# Altium schematic sheet Light Gates.SchDoc: Dual Feeder -
size Letter; DrawnBy: Mark Harris; Engineer: Mark Harris; Organization: Mark Harris; ProjectName: Dual Feeder Controller
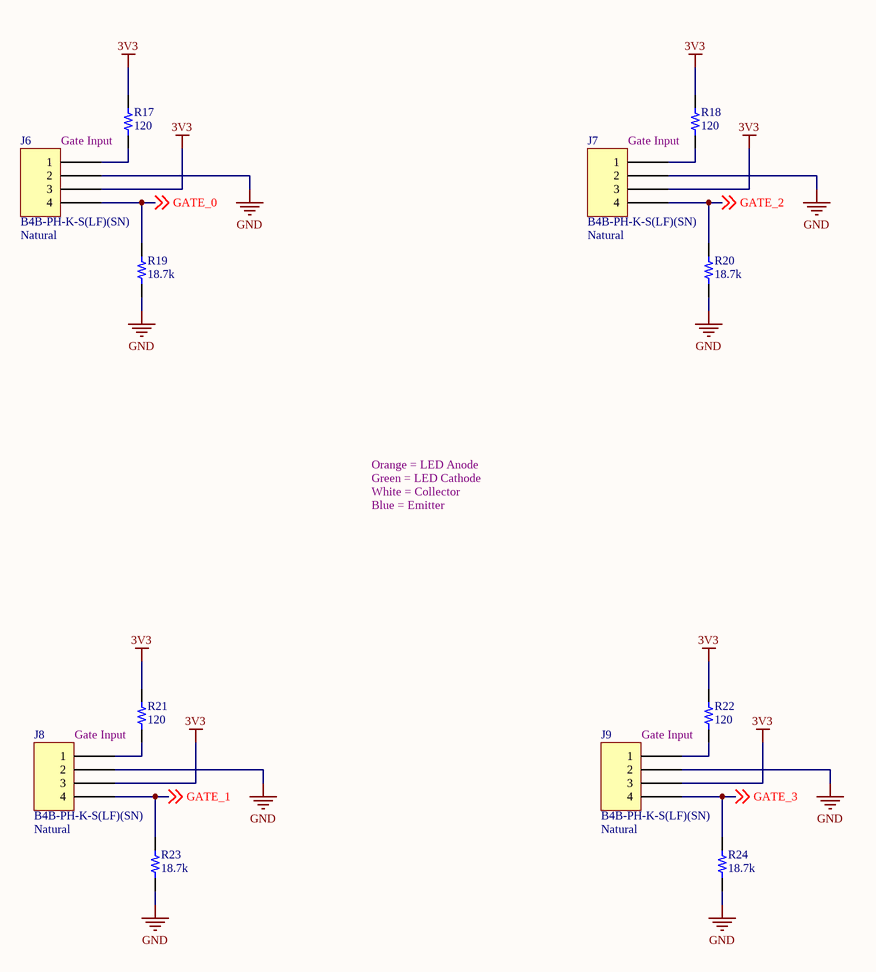
[diagram p0: Light Gates.SchDoc]

## Parts
J6  B4B-PH-K-S(LF)(SN)  Colour: Natural  [JST B4B-PH-K]
J7  B4B-PH-K-S(LF)(SN)  Colour: Natural  [JST B4B-PH-K]
J8  B4B-PH-K-S(LF)(SN)  Colour: Natural  [JST B4B-PH-K]
J9  B4B-PH-K-S(LF)(SN)  Colour: Natural  [JST B4B-PH-K]
R17  120  [RES 0603/1608]
R18  120  [RES 0603/1608]
R19  18.7k  [RES 0603/1608]
R20  18.7k  [RES 0603/1608]
R21  120  [RES 0603/1608]
R22  120  [RES 0603/1608]
R23  18.7k  [RES 0603/1608]
R24  18.7k  [RES 0603/1608]

## Nets
3V3: J6.3 J7.3 J8.3 J9.3 R17.2 R18.2 R21.2 R22.2
GND: J6.2 J7.2 J8.2 J9.2 R19.1 R20.1 R23.1 R24.1
GATE_0: J6.4 R19.2 ; off-sheet GATE_0
GATE_1: J8.4 R23.2 ; off-sheet GATE_1
GATE_2: J7.4 R20.2 ; off-sheet GATE_2
GATE_3: J9.4 R24.2 ; off-sheet GATE_3
NetJ6_1: J6.1 R17.1
NetJ7_1: J7.1 R18.1
NetJ8_1: J8.1 R21.1
NetJ9_1: J9.1 R22.1

## Notes on the sheet
- Gate Input
- Orange = LED Anode
- Green = LED Cathode
- Blue = Emitter
- White = Collector
- Title
- Size:
- Date:
- Letter
- Number:
- Time:
- Revision:
- Sheet
- of
- File:

## Library data of the parts
J6-J9 = B4B-PH-K-S(LF)(SN): CONN HEADER PH TOP 4POS 2MM; Manufacturer: JST Sales America Inc.; Pitch: 0.079" (2.00mm); Number Of Positions: 4; Part Number: B4B-PH-K-S(LF)(SN); PartId: 29449; Supplier 1: Digi-Key; Supplier Part Number 1: 455-1706-ND; ComponentLink1Description: Datasheet; ComponentLink1URL: http://www.jst-mfg.com/product/pdf/eng/ePH.pdf; ComponentLink2Description: Digi-Key Listing; ComponentLink2URL: http://www.digikey.com/product-detail/en/jst-sales-america-inc/B4B-PH-K-S(LF)(SN)/455-1706-ND/926613; Price: 0.24; Type: Header, Shrouded; Contact Finish: Tin; Fastening Type: Detent Lock; Number Of Rows: 1; Series: PH
R17 R18 R21 R22 = ERJ-3EKF1200V: RES SMD 120 OHM 1% 1/10W 0603; Manufacturer: Panasonic Electronic Components; TemperatureRange: -55C ~ 155C; TemperatureCoefficient: 100ppm/C; PowerRating: 0.1W, 1/10W; Value: 120; Part Number: ERJ-3EKF1200V; PartId: 1009; Supplier 1: Digi-Key; Supplier Part Number 1: P120HTR-ND; ComponentLink1Description: Datasheet; ComponentLink1URL: http://industrial.panasonic.com/www-cgi/jvcr13pz.cgi?E+PZ+3+AOA0002+ERJ3EKF1200V+7+WW; ComponentLink2Description: Digi-Key listing; ComponentLink2URL: http://digikey.com/product-detail/en/ERJ-3EKF1200V/P120HTR-ND/1746300; Tolerance: 1%; Price: 0.0038; Type: Thick Film; Device Package: 0603 (1608 Metric)
R19 R20 R23 R24 = ERJ-3EKF1872V: RES SMD 18.7K OHM 1% 1/10W 0603; Manufacturer: Panasonic Electronic Components; TemperatureRange: -55C ~ 155C; TemperatureCoefficient: 100ppm/C; PowerRating: 0.1W, 1/10W; Value: 18.7k; Part Number: ERJ-3EKF1872V; PartId: 1052; Supplier 1: Digi-Key; Supplier Part Number 1: P18.7KHTR-ND; ComponentLink1Description: Datasheet; ComponentLink1URL: http://industrial.panasonic.com/www-cgi/jvcr13pz.cgi?E+PZ+3+AOA0002+ERJ3EKF1872V+7+WW; ComponentLink2Description: Digi-Key listing; ComponentLink2URL: http://digikey.com/product-detail/en/ERJ-3EKF1872V/P18.7KHTR-ND/196169; Tolerance: 1%; Price: 0.0038; Type: Thick Film; Device Package: 0603 (1608 Metric)